# Altium schematic sheet hx711.SchDoc
size A4
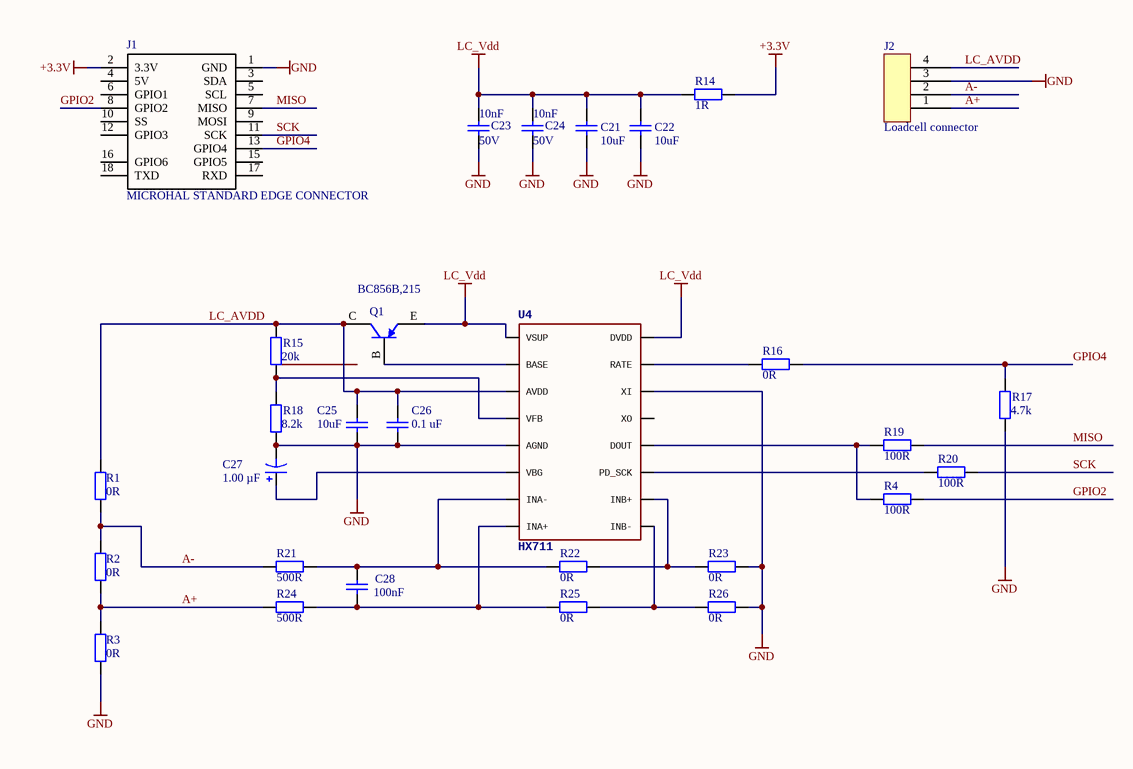
[diagram p0: hx711.SchDoc]

## Parts
C21  Capacitance: 10uF  [CAPC2113X120X50LL20T30]  (hidden comment: AVX Interconnect / Elco TAJR106K006RNJ)
C22  Capacitance: 10uF  [CAPC2113X120X50LL20T30]  (hidden comment: AVX Interconnect / Elco TAJR106K006RNJ)
C23  Capacitance: 10nF  Voltage Rating (DC): 50V  [PCB-19299713-1]  (hidden comment: 0603N103J500)
C24  Capacitance: 10nF  Voltage Rating (DC): 50V  [PCB-19299713-1]  (hidden comment: 0603N103J500)
C25  Capacitance: 10uF  [CAPC2113X120X50LL20T30]  (hidden comment: AVX Interconnect / Elco TAJR106K006RNJ)
C26  Capacitance: 0.1 uF  [PCB-121845-2]  (hidden comment: Murata GRM31C5C1E104JA01L)
C27  Capacitance: 1.00 µF  [CAPC3216X180X80NL20T30]  (hidden comment: Kemet T491A105M016AT)
C28  100nF  [PCB-121845-2]
J1  MICROHAL STANDARD EDGE CONNECTOR  [PCB-n61ghpg3sznbl2uw6fwj-1]
J2  Loadcell connector  [PCBComponent_1]
Q1  BC856B,215  [SOT23-BEC]
R1  Resistance: 0R  [0603]
R2  Resistance: 0R  [0603]
R3  Resistance: 0R  [0603]
R4  Resistance: 100R  [0603]
R14  Resistance: 1R  [0603]
R15  Resistance: 20k  [0603]
R16  Resistance: 0R  [0603]
R17  Resistance: 4.7k  [0603]
R18  Resistance: 8.2k  [0603]
R19  Resistance: 100R  [0603]
R20  Resistance: 100R  [0603]
R21  Resistance: 500R  [0603]
R22  Resistance: 0R  [0603]
R23  Resistance: 0R  [0603]
R24  Resistance: 500R  [0603]
R25  Resistance: 0R  [0603]
R26  Resistance: 0R  [0603]
U4  HX711  [CYP-SX16_L]

## Nets
+3.3V: J1.2(3.3V) R14.1
GND: C21.2 C22.2 C23.1 C24.1 C25.1 C26.1 C27.2(-) J1.1(GND) J2.3 R3.2 R17.1 R18.1 R23.1 R26.1 U4.5(AGND) U4.14(XI)
LC_Vdd: C21.1 C22.1 C23.2 C24.2 Q1.E R14.2 U4.1(VSUP) U4.16(DVDD)
A+: J2.1 R2.2 R3.1 R24.2
A-: J2.2 R1.2 R2.1 R21.2
GPIO2: J1.8(GPIO2) R4.1
GPIO4: J1.13(GPIO4) R16.1 R17.2
LC_AVDD: C25.2 C26.2 J2.4 Q1.C R1.1 R15.2 U4.3(AVDD)
MISO: J1.7(MISO) R19.1
SCK: J1.11(SCK) R20.1
NetC27_1: C27.1(+) U4.6(VBG)
NetC28_1: C28.1 R24.1 R25.2 U4.8(INA+)
NetC28_2: C28.2 R21.1 R22.2 U4.7(INA-)
NetQ1_B: Q1.B U4.2(BASE)
NetR4_2: R4.2 R19.2 U4.12(DOUT)
NetR15_1: R15.1 R18.2 U4.4(VFB)
NetR16_2: R16.2 U4.15(RATE)
NetR20_2: R20.2 U4.11(PD_SCK)
NetR22_1: R22.1 R23.2 U4.10(INB+)
NetR25_1: R25.1 R26.2 U4.9(INB-)

Not connected (* = marked no-connect by the designer): J1 3(SDA) 4(5V) 5(SCL) 6(GPIO1) 9(MOSI) 10(SS) 12(GPIO3) 15(GPIO5) 16(GPIO6) 17(RXD) 18(TXD); U4 13(XO)

## Library data of the parts
C21 C22 C25 = CMP-222801-1: CAP TANT 10UF 6.3V 10% 0805; DCL: 0.6uA; ESR: 6ohm; Seal: Not Required; Voltage: 6.3VDC; Product Depth (mm): 1.3mm; Product Height (mm): 1.2mm; CiivaID: 222801; DF: 8%; Case Style: Molded; Product Diameter (mm): Not Requiredmm; Product Length (mm): 2.05mm; Polarity: Polar; Ciiva URL: https://ciiva.com/part/tajr106k006rnj-222801; Packaging: Tape and Reel; Failure Rate: Not Required; Package / Case: 2012-12; Tolerance (+ or -): 10%; Case Code: R; Construction: SMT Chip; Wire Form: Not Required; Seated Plane Height: Not Requiredmm; Length W/Weld: Not Requiredmm; Insulation: Not Required; Manufacturer Part Number: TAJR106K006RNJ; Operating Temp Range: -55C to 125C; Lead Spacing (nom): Not Requiredmm; Mounting Style: Surface Mount
C23 C24 = CMP-19299713-2: Case/Package (SI): 0603; Dielectric: C0G; Part identifier: 0603N103J500
C26 = CMP-121845-1: CAP CER 0.1UF 25V 5% NP0 1206; Case Width: 1.6 mm; Temperature Coefficient / Code: +/- 30 PPM / C; Brand: Murata Electronics; Capacitance - nF: 100 nF; Capacitance - pF: 100000 pF; Type: General Purpose MLCC; Dielectric: C0G (NP0); Case Length: 3.2 mm; CiivaID: 121845; Voltage Rating: 25 V; Factory Pack Quantity: 2000; Ciiva URL: https://ciiva.com/part/grm31c5c1e104ja01l-121845; Tolerance: 5 %; Operating Temperature Range: - 55 C to + 125 C; RoHS: Details; Packaging: Reel; Manufacturer: Murata; Manufacturer Part Number: GRM31C5C1E104JA01L; Minimum Operating Temperature: - 55 C; Case Code - mm: 3216; Product Category: Multilayer Ceramic Capacitors MLCC - SMD/SMT; Series: GRM; Case Height: 1.6 mm; Case Code - in: 1206; Maximum Operating Temperature: + 125 C; Product: General Type MLCCs; Voltage Rating DC: 25 V; Package / Case: 1206 (3216 metric); Termination Style: SMD/SMT; Dimensions: 1.6 mm W x 3.2 mm L x 1.6 mm H
C27 = CMP-52579b5e2d498d90-1: Cap Tant Solid 1uF 16V A CASE 20% (3.2 X 1.6 X 1.6mm) SMD 3216-18 10 Ohm 125C Automotive T/R; Lead-Free Status: Lead Free; Equivalent Series Resistance (ESR): 10.0 Ω; Voltage Rating (DC): 16.0 V; OctopartID: 52579b5e2d498d90; Case/Package: 3216-18; Size-Width: 1.60 mm; Size-Length: 3.20 mm; Manufacturer Part Number: T491A105M016AT; Number of Pins: 2; Capacitance Tolerance: ±20%; Size-Height: 1.60 mm; Octopart URL: http://octopart.com/t491a105m016at-kemet-219768; Packaging: Cut Tape (CT); Case/Package (SI): 3216-18; REACH SVHC Compliance: No SVHC; RoHS: Compliant; Mounting Style: Surface Mount
C28 = CMP-121845-2: CAP CER 0.1UF 25V 5% NP0 1206; Capacitance: 1e-07 F; Case/Package (SI): 3216; Dielectric Characteristic: C0G/NP0; Dielectric Material: Ceramic Multilayer; Insulation Resistance: 10000000000.0 Ω; Lead-Free Status: Lead Free; Voltage Rating (DC): 25.0 V; Capacitance Tolerance: ±5%; Lifecycle Status: Active; Mounting Style: Surface Mount; Number of Pins: 2; Octopart Url: https://octopart.com/grm31c5c1e104ja01l-murata-196479; OctopartID: 7fd4b6dca5cda013; REACH SVHC Compliance: No SVHC; RoHS: Compliant; Size-Height: 0.0016 m; Size-Length: 0.0032 m; Size-Thickness: 0.0016 m; Size-Width: 0.0016 m
J1 = CMP-6a3uyflm72uf0am1b36s-2: microhal standard edge connector with 17 pins
J2 = CMP-5c1097d27ab083d7-2: Wire-To-Board Connector, AMPMODU Mod II Series, Through Hole, Header, 4, 2.54 mm; Manufacturer Part Number: 826926-4; Lead-Free Status: Lead Free; Pin Pitch: 0.00254 m; ELV Compliant: Compliant; Gender: Male; Current Rating: 3.0 A; Number of Contacts: 4; OctopartID: 5c1097d27ab083d7; Packaging: Box; Contact Plating: Tin; Housing Material: Thermoplastic; REACH SVHC Compliance: No SVHC; Housing Color: Green; RoHS: Compliant; Flammability Rating: UL 94 V-0; Octopart URL: http://octopart.com/826926-4-te+connectivity-46662598; Lifecycle Status: Active; Mounting Style: PCB; Contact Material: Phosphor Bronze; Orientation: Vertical
Q1 = CMP-856318-2: TRANS PNP 65V 0.1A SOT23; Lead-Free Status: Lead Free; Lifecycle Status: Active; Mounting Style: Surface Mount; Number of Pins: 3; Octopart Url: https://octopart.com/bc856b%2C215-nxp+semiconductors-10477479; OctopartID: be4477d144856183; Polarity: PNP; REACH SVHC Compliance: No SVHC; RoHS: Compliant
R1-R4 R14-R26 = CMP-8f45450282185082-2: Resistance Tolerance: ±5%
U4 = CMP-8eb44445be3e5173-4: Load Cell Amp HX711; OctopartID: 8eb44445be3e5173